# Altium schematic sheet BSU_Connector.SchDoc: Connector
size A4; Version: 1.0; Sub Team: EEE; Module: PERT-BMS; Generation: NA; Organization: PERT; SheetNumber: 2; SheetTotal: 8
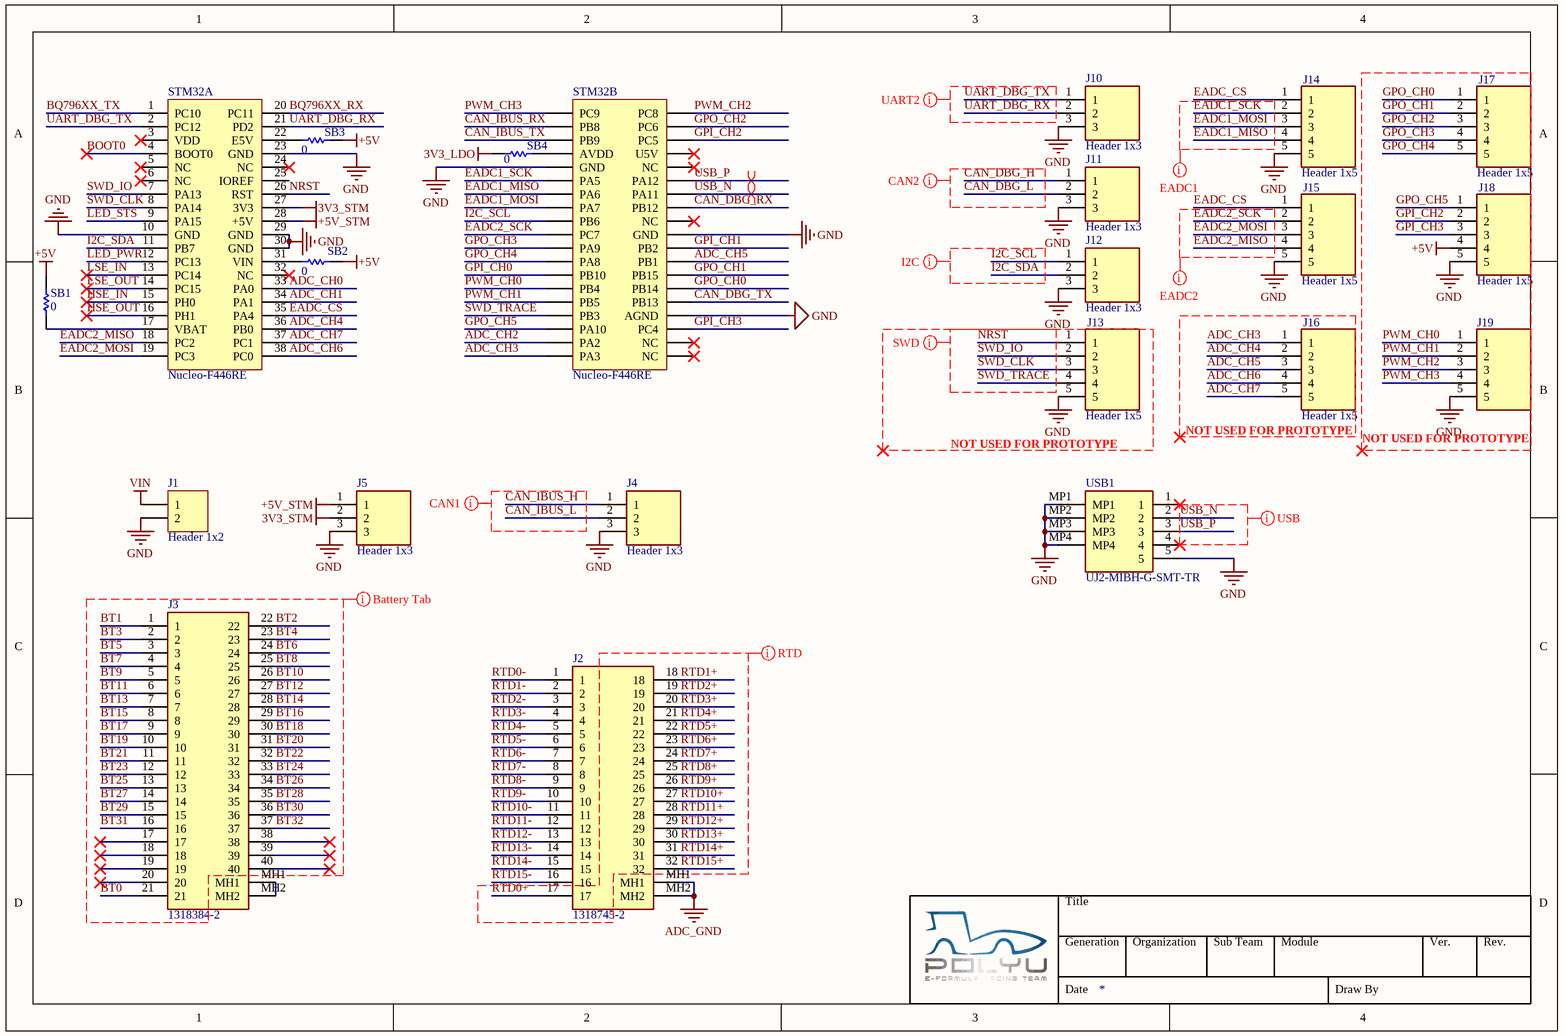
[diagram p0: BSU_Connector.SchDoc]

## Parts
J1  Header 1x2  [HDR_1X2_2.54_THD]
J2  1318745-2  [TH025_32P]
J3  1318384-2  [TH025_40P]
J4  Header 1x3  [HDR_1X3_2.54_THD]
J5  Header 1x3  [HDR_1X3_2.54_THD]
J10  Header 1x3  [HDR_1X3_2.54_THD]
J11  Header 1x3  [HDR_1X3_2.54_THD]
J12  Header 1x3  [HDR_1X3_2.54_THD]
J13  Header 1x5  [HDR_1X5_2.54_THD]  (graphical)
J14  Header 1x5  [HDR_1X5_2.54_THD]
J15  Header 1x5  [HDR_1X5_2.54_THD]
J16  Header 1x5  [HDR_1X5_2.54_THD]  (graphical)
J17  Header 1x5  [HDR_1X5_2.54_THD]  (graphical)
J18  Header 1x5  [HDR_1X5_2.54_THD]  (graphical)
J19  Header 1x5  [HDR_1X5_2.54_THD]  (value not drawn)  (graphical)
SB1  0  [0805_SMD_R]
SB2  0  [0805_SMD_R]
SB3  0  [0805_SMD_R]
SB4  0  [0805_SMD_R]
STM32  Nucleo-F446RE  [NUCLEO-F446RE]  (parts A,B of 2)  (no BOM)
USB1  UJ2-MIBH-G-SMT-TR  [USB_B_5P_SMD]

## Nets
3V3_LDO: SB4.2
3V3_STM: J5.2 STM32.27(3V3)
+5V: J18.4 SB1.2 SB2.1 SB3.1
+5V_STM: J5.1 STM32.28(+5V)
ADC_GND: J2.MH1 J2.MH2
GND: J1.2 J4.3 J5.3 J10.3 J11.3 J12.3 J13.5 J14.5 J15.5 J18.5 J19.5 STM32.10(GND) STM32.23(GND) STM32.29(GND) STM32.30(GND) STM32.43(GND) STM32.67(GND) STM32.73(AGND) USB1.5 USB1.MP1 USB1.MP2 USB1.MP3 USB1.MP4
VIN: J1.1
ADC_CH0: STM32.33(PA0)
ADC_CH1: STM32.34(PA1)
ADC_CH2: STM32.56(PA2)
ADC_CH3: J16.1 STM32.57(PA3)
ADC_CH4: J16.2 STM32.36(PB0)
ADC_CH5: J16.3 STM32.69(PB1)
ADC_CH6: J16.4 STM32.38(PC0)
ADC_CH7: J16.5 STM32.37(PC1)
BOOT0: STM32.4(BOOT0)
BQ796XX_RX: STM32.20(PC11)
BQ796XX_TX: STM32.1(PC10)
BT0: J3.21
BT1: J3.1
BT2: J3.22
BT3: J3.2
BT4: J3.23
BT5: J3.3
BT6: J3.24
BT7: J3.4
BT8: J3.25
BT9: J3.5
BT10: J3.26
BT11: J3.6
BT12: J3.27
BT13: J3.7
BT14: J3.28
BT15: J3.8
BT16: J3.29
BT17: J3.9
BT18: J3.30
BT19: J3.10
BT20: J3.31
BT21: J3.11
BT22: J3.32
BT23: J3.12
BT24: J3.33
BT25: J3.13
BT26: J3.34
BT27: J3.14
BT28: J3.35
BT29: J3.15
BT30: J3.36
BT31: J3.16
BT32: J3.37
CAN_DBG_H: J11.1
CAN_DBG_L: J11.2
CAN_DBG_RX: STM32.65(PB12)
CAN_DBG_TX: STM32.72(PB13)
CAN_IBUS_H: J4.1
CAN_IBUS_L: J4.2
CAN_IBUS_RX: STM32.40(PB8)
CAN_IBUS_TX: STM32.41(PB9)
EADC1_MISO: J14.4 STM32.45(PA6)
EADC1_MOSI: J14.3 STM32.46(PA7)
EADC1_SCK: J14.2 STM32.44(PA5)
EADC2_MISO: J15.4 STM32.18(PC2)
EADC2_MOSI: J15.3 STM32.19(PC3)
EADC2_SCK: J15.2 STM32.48(PC7)
EADC_CS: J14.1 J15.1 STM32.35(PA4)
GPI_CH0: STM32.51(PB10)
GPI_CH1: STM32.68(PB2)
GPI_CH2: J18.2 STM32.60(PC5)
GPI_CH3: J18.3 STM32.74(PC4)
GPO_CH0: J17.1 STM32.71(PB14)
GPO_CH1: J17.2 STM32.70(PB15)
GPO_CH2: J17.3 STM32.59(PC6)
GPO_CH3: J17.4 STM32.49(PA9)
GPO_CH4: J17.5 STM32.50(PA8)
GPO_CH5: J18.1 STM32.55(PA10)
HSE_IN: STM32.15(PH0)
HSE_OUT: STM32.16(PH1)
I2C_SCL: J12.1 STM32.47(PB6)
I2C_SDA: J12.2 STM32.11(PB7)
LED_PWR: STM32.12(PC13)
LED_STS: STM32.9(PA15)
LSE_IN: STM32.13(PC14)
LSE_OUT: STM32.14(PC15)
NRST: J13.1 STM32.26(RST)
PWM_CH0: J19.1 STM32.52(PB4)
PWM_CH1: J19.2 STM32.53(PB5)
PWM_CH2: J19.3 STM32.58(PC8)
PWM_CH3: J19.4 STM32.39(PC9)
RTD0+: J2.17
RTD0-: J2.1
RTD1+: J2.18
RTD1-: J2.2
RTD2+: J2.19
RTD2-: J2.3
RTD3+: J2.20
RTD3-: J2.4
RTD4+: J2.21
RTD4-: J2.5
RTD5+: J2.22
RTD5-: J2.6
RTD6+: J2.23
RTD6-: J2.7
RTD7+: J2.24
RTD7-: J2.8
RTD8+: J2.25
RTD8-: J2.9
RTD9+: J2.26
RTD9-: J2.10
RTD10+: J2.27
RTD10-: J2.11
RTD11+: J2.28
RTD11-: J2.12
RTD12+: J2.29
RTD12-: J2.13
RTD13+: J2.30
RTD13-: J2.14
RTD14+: J2.31
RTD14-: J2.15
RTD15+: J2.32
RTD15-: J2.16
SWD_CLK: J13.3 STM32.8(PA14)
SWD_IO: J13.2 STM32.7(PA13)
SWD_TRACE: J13.4 STM32.54(PB3)
UART_DBG_RX: J10.2 STM32.21(PD2)
UART_DBG_TX: J10.1 STM32.2(PC12)
USB_N: STM32.64(PA11) USB1.2
USB_P: STM32.63(PA12) USB1.3
NetJ3_MH1: J3.MH1 J3.MH2
NetSB1_1: SB1.1 STM32.17(VBAT)
NetSB2_2: SB2.2 STM32.31(VIN)
NetSB3_2: SB3.2 STM32.22(E5V)
NetSB4_1: SB4.1 STM32.42(AVDD)

Not connected (* = marked no-connect by the designer): J3 17* 18* 19* 20* 38* 39* 40*; STM32 3(VDD)* 5(NC)* 6(NC)* 24(NC)* 25(IOREF) 32(NC)* 61(U5V)* 62(NC)* 66(NC)* 75(NC)* 76(NC)*; USB1 1* 4*

## Layout directives
differential pair: USB_N, USB_P
net class SWD; rule Matched Net Lengths [Tolerance = 1mm]: NRST, SWD_CLK, SWD_IO, SWD_TRACE
net class I2C; rule Matched Net Lengths [Tolerance = 1mm]: I2C_SCL, I2C_SDA
net class CAN2_DIFF; rule Differential Pairs Routing [Pref Gap = 0.254mm    Min Gap  = 0.127mm    Max Gap  = 0.254mmPref Width = 0.254mm    Min Width  = 0.127mm    Max Width  = 0.381mm]: CAN_DBG_H, CAN_DBG_L
net class UART2; rule Matched Net Lengths [Tolerance = 1mm]: UART_DBG_RX, UART_DBG_TX
net class USB; rule Matched Net Lengths [Tolerance = 1mm]: USB_N, USB_P
net class CAN1_DIFF; rule Differential Pairs Routing [Pref Gap = 0.254mm    Min Gap  = 0.127mm    Max Gap  = 0.254mmPref Width = 0.254mm    Min Width  = 0.127mm    Max Width  = 0.381mm]: CAN_IBUS_H, CAN_IBUS_L
net class EADC1; rule Matched Net Lengths [Tolerance = 1mm]: EADC1_MISO, EADC1_MOSI, EADC1_SCK
net class EADC2; rule Matched Net Lengths [Tolerance = 1mm]: EADC2_MISO, EADC2_MOSI, EADC2_SCK
net class BT: BT0, BT1, BT2, BT3, BT4, BT5, BT6, BT7, BT8, BT9, BT10, BT11, BT12, BT13, BT14, BT15, BT16, BT17, BT18, BT19, BT20, BT21, BT22, BT23, BT24, BT25, BT26, BT27, BT28, BT29, BT30, BT31, BT32
net class RTD: RTD0+, RTD1+, RTD2+, RTD3+, RTD4+, RTD5+, RTD6+, RTD7+, RTD8+, RTD9+, RTD10+, RTD11+, RTD12+, RTD13+, RTD14+, RTD15+

## Notes on the sheet
- NOT USED FOR PROTOTYPE
- (near J16) NOT USED FOR PROTOTYPE
- (near J19) NOT USED FOR PROTOTYPE
- Title
- Generation
- Organization
- Sub Team
- Module
- Ver.
- Rev.
- Date
- Draw By

## Library data of the parts
J1 = Header 1x2: Header, 2-Pin
J2 = TE TH/.25 32P TH: TE CONNECTIVITY - 1318745-2 - Automotive Connector, TH 025 Series, Right Angle Plug, 32 Contacts, Crimp Pin; Geometry.Height: 15.5mm; Mouser Part Number: 571-1318745-2; Mouser Price/Stock: https://www.mouser.co.uk/ProductDetail/TE-Connectivity-AMP/1318745-2?qs=ajJfoEgdyuQ%2FBs4LKkUxbA%3D%3D; Manufacturer_Name: TE Connectivity; Manufacturer_Part_Number: 1318745-2; Datasheet Link: https://www.te.com/commerce/DocumentDelivery/DDEController?Action=showdoc&DocId=Customer+Drawing%7F1318745%7FB6%7Fpdf%7FJapanese%7FJPN_CD_1318745_B6.pdf%7F1318745-2
J3 = TE TH/.25 40P TH: TE Connectivity TH 025 Series, 2 Row 40 Way Through Hole Socket Automotive Header Connector, Automotive wiring; Geometry.Height: 15.5mm; Mouser Part Number: 571-1318384-2; Mouser Price/Stock: https://www.mouser.co.uk/ProductDetail/TE-Connectivity/1318384-2?qs=ajJfoEgdyuQdiyFC%2FqjiIw%3D%3D; Manufacturer_Name: TE Connectivity; Manufacturer_Part_Number: 1318384-2; Datasheet Link: https://datasheet.datasheetarchive.com/originals/distributors/Datasheets_SAMA/2d817f87a4b79b3277c4981d7cac1338.pdf
J4 J5 J10-J12 = Header 1x3: Pin Header 2.54mm Pitch STR DIP, 1x3Pin, G/F, LCP, 8.08mm*2.54mm*3.18mm, Color-Black, Bag; Manufacturer_Name: Amphenol Communications Solutions; Manufacturer_Part_Number: G800LR305018EU; Geometry.Height: 10.82mm; Mouser Part Number: 523-G800LR305018EU; Mouser Price/Stock: https://www.mouser.co.uk/ProductDetail/Amphenol-Commercial-Products/G800LR305018EU?qs=PzGy0jfpSMsZaVkTJmYyRA%3D%3D; Datasheet Link: https://cdn.amphenol-cs.com/media/wysiwyg/files/drawing/g800lrxxxxxxeu_1.pdf
J13-J19 = Header 1x5: Manufacturer_Name: TE Connectivity; Manufacturer_Part_Number: 87224-5; Geometry.Height: 10.745mm; Datasheet Link: https://www.arrow.com/en/products/87224-5/te-connectivity
SB1-SB4 = 0805_SMD_Resistor: 0805 SMD Resistor; Tolerance: *; Power Rating: *; Temperature Coefficient: *; Value: 0
USB1 = USB_B 5P: USB Connectors USB jack, 2.0, micro B type, 5 pin, horizontal, gold flash, SMT, TR; Manufacturer_Name: CUI Devices; Geometry.Height: 3.15mm; Mouser Part Number: 490-UJ2-MIBH-G-SMTTR; Mouser Price/Stock: https://www.mouser.co.uk/ProductDetail/CUI-Devices/UJ2-MIBH-G-SMT-TR?qs=IS%252B4QmGtzzpvS1XQusp0iA%3D%3D; Manufacturer_Part_Number: UJ2-MIBH-G-SMT-TR; Datasheet Link: cuidevices.com/product/resource/uj2-mibh-g-smt-tr.pdf